# Altium project DIOT_Sampler_Adapter.PrjPCB
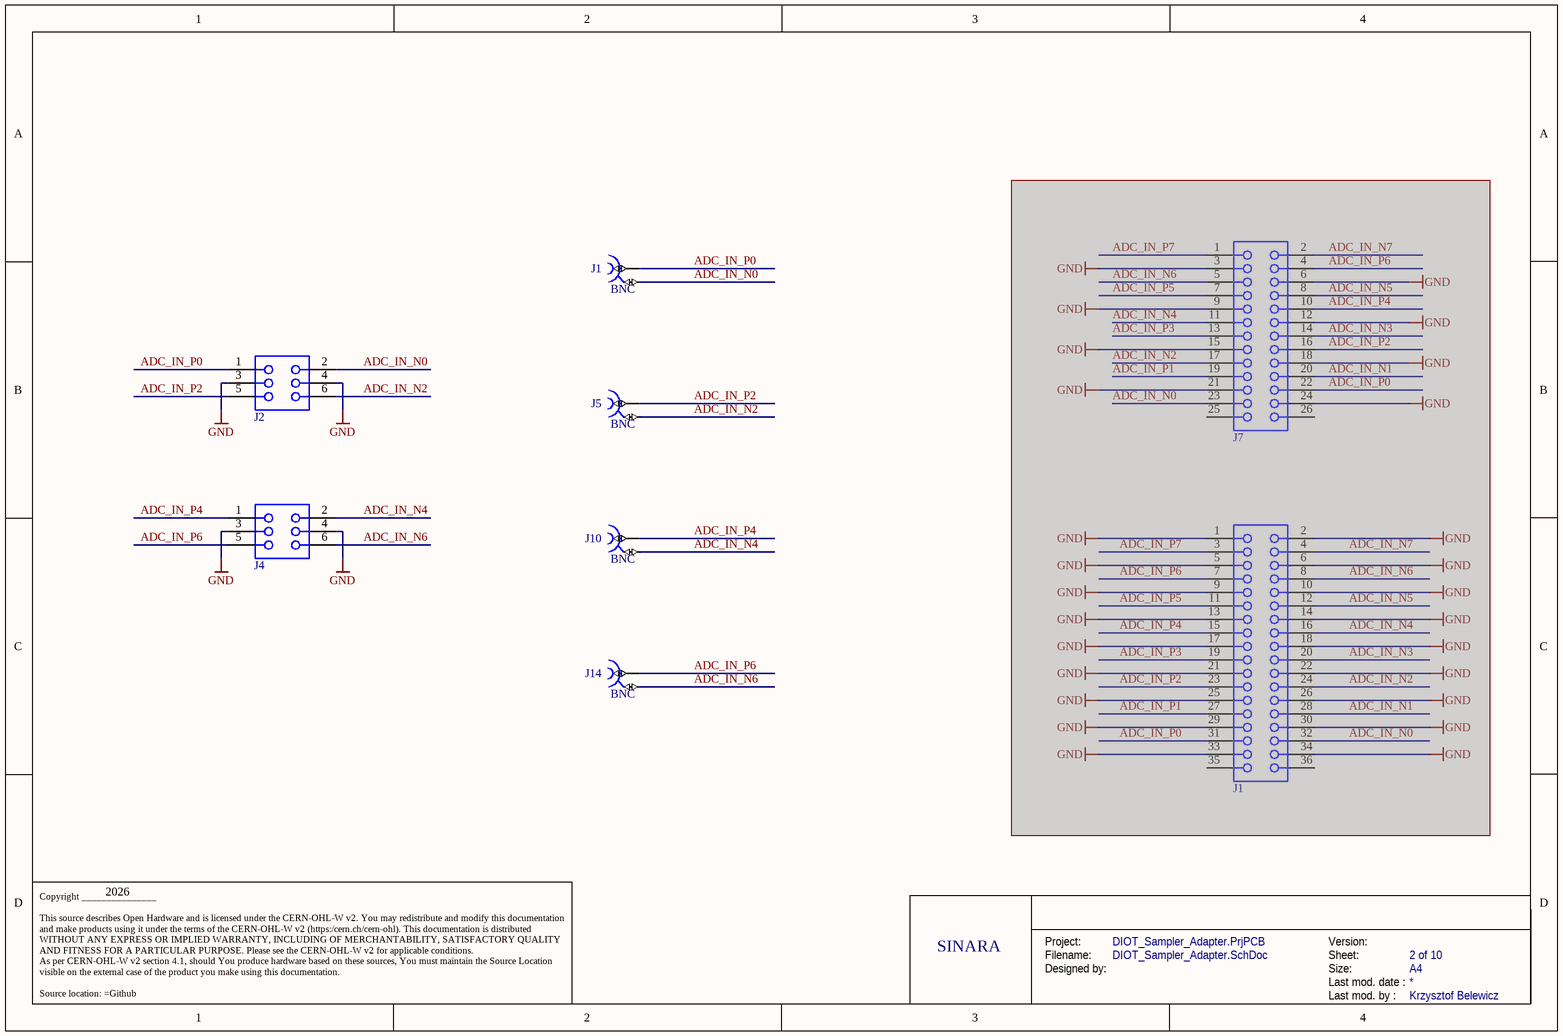
[diagram p0: DIOT_Sampler_Adapter.SchDoc]
P_version: 2.3.1; P_github_link: https://github.com/sinara-hw/Sampler; P_author3: Krzysztof Belewicz; P_author2: Łukasz Pająk; P_author1: Grzegorz Kasprowicz
1 sheet, 8 parts. Net scope: strictly hierarchical (ports join the sheet entries above them; power ports are local).
Board file: DIOT_Sampler_Adapter.PCBDOC

## Sheet DIOT_Sampler_Adapter.SchDoc: =DocumentName
size A4; DocumentNumber: 1; Revision: 0; SheetNumber: 2; SheetTotal: 10; Version: 2.3.1; Author 1: Grzegorz Kasprowicz; Author 2: Łukasz Pająk; Author 3: Krzysztof Belewicz; Github: https://github.com/sinara-hw/Sampler; Last modified by: Krzysztof Belewicz

### Parts
(Parts that share a designator on the sheet are numbered #1, #2 ... from top to bottom, then left to right.)
J1#1  BNC  [MOLEX_73251-3150]
J1#2  61303621821  [61303621821]  (value not drawn)  (masked out: inside a compile mask, not in the netlist)
J2  61300621821  [61300621821]  (value not drawn)
J4  61300621821  [61300621821]  (value not drawn)
J5  BNC  [MOLEX_73251-3150]
J7  61032621821  [61032621821]  (value not drawn)  (masked out: inside a compile mask, not in the netlist)
J10  BNC  [MOLEX_73251-3150]
J14  BNC  [MOLEX_73251-3150]

### Nets
GND: J2.3 J2.4 J4.3 J4.4
ADC_IN_N0: J1#1.2 J2.2
ADC_IN_N2: J2.6 J5.2
ADC_IN_N4: J4.2 J10.2
ADC_IN_N6: J4.6 J14.2
ADC_IN_P0: J1#1.1 J2.1
ADC_IN_P2: J2.5 J5.1
ADC_IN_P4: J4.1 J10.1
ADC_IN_P6: J4.5 J14.1

### Notes on the sheet
- 2026
- SINARA
- Project:
- Designed by:
- Filename:
- Size:
- Version:
- Last mod. date :
- Sheet:
- A4
- Copyright _______________
  This source describes Open Hardware and is licensed under the CERN-OHL-W v2. You may redistribute and modify this documentation and make products using it under the terms of the CERN-OHL-W v2 (https:/cern.ch/cern-ohl). This documentation is distributed WITHOUT ANY EXPRESS OR IMPLIED WARRANTY, INCLUDING OF MERCHANTABILITY, SATISFACTORY QUALITY AND FITNESS FOR A PARTICULAR PURPOSE. Please see the CERN-OHL-W v2 for applicable conditions.
  As per CERN-OHL-W v2 section 4.1, should You produce hardware based on these sources, You must maintain the Source Location visible on the external case of the product you make using this documentation.
  Source location: =Github
- Last mod. by :

### Library data of the parts
J1#1 J5 J10 J14 = MOLEX_73251-3150: Part Description: RF Connectors / Coaxial Connectors BNC RA PCB RECPT 50 OHM; Manufacturer: MOLEX; PressFit: No; Part Number: MOLEX_73251-3150; Component Kind: Standard; Component Type: Standard; Pin Count: 5; Family: BNC; Mounted: Yes; Socket: No; SMD: No; Sense: No; Status: None; Manufacturer Part Number: 73251-3150; HelpURL: \\cern.ch\dfs\Applications\Altium\Datasheets\MOLEX_73251-2121.pdf; Author: CERN DEM JLC; CreateDate: 19.09.2024; LatestRevisionDate: 19.09.2024
J1#2 = 61303621821: WR-PHD Socket Header, THT, Vertical, pitch 2.54mm, 2 Row, 36P; Manufacturer: Wurth Elektronik; Contact Resistance: 20mOhm; Rated Current: 3A; Working Voltage: 250V; Withstanding Voltage: 500V; Manufacturer Part Number: 61303621821; Category: Board-to-Board Connectors; Match Code: WR-PHD; ComponentLink1Description: Website Link; ComponentLink1URL: https://www.we-online.com/redexpert/article/61303621821?ad; ComponentLink2Description: Datasheet Link; ComponentLink2URL: https://www.we-online.com/redexpert/spec/61303621821?ad; Mount: Through Hole; Operating Temperature Max: 125°C; Operating Temperature Min: -40°C; Packaging: Tray; Gender: Socket Header; Number of Pins: 36; Number of Rows: 2; Orientation: Vertical; Pitch: 2.54mm
J2 J4 = 61300621821: WR-PHD Socket Header, THT, Vertical, pitch 2.54mm, 2 Row, 6P; Manufacturer: Wurth Elektronik; Contact Resistance: 20mOhm; Rated Current: 3A; Working Voltage: 250V; Withstanding Voltage: 500V; Manufacturer Part Number: 61300621821; Category: Board-to-Board Connectors; Match Code: WR-PHD; ComponentLink1Description: Website Link; ComponentLink1URL: https://www.we-online.com/redexpert/article/61300621821?ad; ComponentLink2Description: Datasheet Link; ComponentLink2URL: https://www.we-online.com/redexpert/spec/61300621821?ad; Mount: Through Hole; Operating Temperature Max: 125°C; Operating Temperature Min: -40°C; Packaging: Tray; Gender: Socket Header; Number of Pins: 6; Number of Rows: 2; Orientation: Vertical; Pitch: 2.54mm
J7 = 61032621821: WR-PHD Socket Header, SMT, Vertical, pitch 2.54mm, 2 Row, 26P; Manufacturer: Wurth Elektronik; Contact Resistance: 20mOhm; Rated Current: 3A; Working Voltage: 250V; Withstanding Voltage: 600V; Manufacturer Part Number: 61032621821; Category: Board-to-Board Connectors; Match Code: WR-PHD; ComponentLink1Description: Website Link; ComponentLink1URL: https://www.we-online.com/redexpert/article/61032621821?ad; ComponentLink2Description: Datasheet Link; ComponentLink2URL: https://www.we-online.com/redexpert/spec/61032621821?ad; Mount: Surface Mount; Operating Temperature Max: 105°C; Operating Temperature Min: -40°C; Packaging: Tape and Reel; Gender: Socket Header; Number of Pins: 26; Number of Rows: 2; Orientation: Vertical; Pitch: 2.54mm